# Altium schematic sheet GPS Module.SchDoc
size A4; SheetNumber: 3; SheetTotal: 3
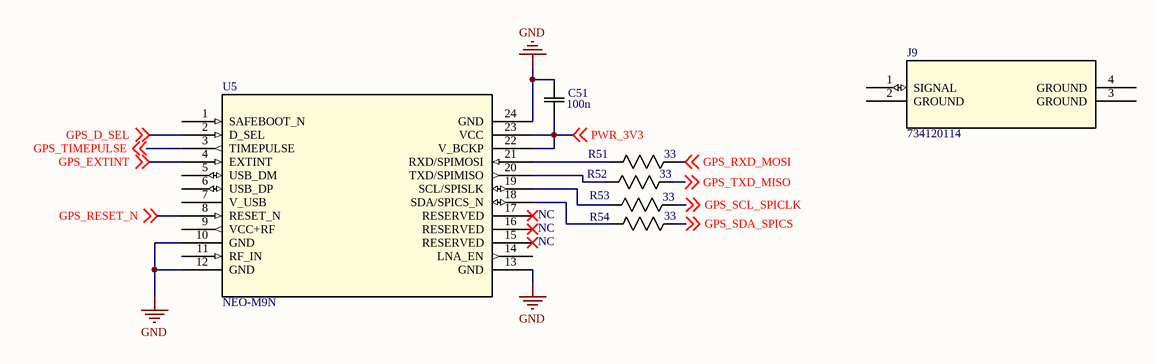
[diagram p0: GPS Module.SchDoc]

## Parts
C51  100n  [YAG_CC0603_YAG]
J9  734120114  [73412-0114_MOL]
R51  33  [RC0603N_VIS]
R52  33  [RC0603N_VIS]
R53  33  [RC0603N_VIS]
R54  33  [RC0603N_VIS]
U5  NEO-M9N  [NEO-M9N_UBL]

## Nets
GND: C51.2 U5.10(GND) U5.12(GND) U5.13(GND) U5.24(GND)
GPS_D_SEL: U5.2(D_SEL) ; off-sheet GPS_D_SEL
GPS_EXTINT: U5.4(EXTINT) ; off-sheet GPS_EXTINT
GPS_RESET_N: U5.8(RESET_N) ; off-sheet GPS_RESET_N
GPS_RXD_MOSI: R51.2 ; off-sheet GPS_RXD_MOSI
GPS_SCL_SPICLK: R53.2 ; off-sheet GPS_SCL_SPICLK
GPS_SDA_SPICS: R54.2 ; off-sheet GPS_SDA_SPICS
GPS_TIMEPULSE: U5.3(TIMEPULSE) ; off-sheet GPS_TIMEPULSE
GPS_TXD_MISO: R52.2 ; off-sheet GPS_TXD_MISO
PWR_3V3: C51.1 U5.22(V_BCKP) U5.23(VCC) ; off-sheet PWR_3V3
NetR51_1: R51.1 U5.21(RXD/SPIMOSI)
NetR52_1: R52.1 U5.20(TXD/SPIMISO)
NetR53_1: R53.1 U5.19(SCL/SPISLK)
NetR54_1: R54.1 U5.18(SDA/SPICS_N)

Not connected (* = marked no-connect by the designer): J9 1(SIGNAL) 2(GROUND) 3(GROUND) 4(GROUND); U5 1(SAFEBOOT_N) 5(USB_DM) 6(USB_DP) 7(V_USB) 9(VCC+RF) 11(RF_IN) 14(LNA_EN) 15(RESERVED)* 16(RESERVED)* 17(RESERVED)*

## Notes on the sheet
- NC
- (near U5) NC

## Library data of the parts
C51 = CC0603KRX7R8BB104: No Description Available; Mfr_Name: Yageo; Type: DEV; Copyright: Copyright (C) 2024 Ultra Librarian. All rights reserved.; Manufacturer_Part_Number: CC0603KRX7R8BB104; RefDes: RefDes
J9 = 734120114: No Description Available; Mfr_Name: Molex Connector Corporation; RefDes: RefDes; Type: Type
R51-R54 = RES(10K, SMD-603): Mfr_Name: Vishay
U5 = NEO-M9N: No Description Available; Mfr_Name: Ublox; RefDes: RefDes; Type: Type